# EAGLE design pvsim (EAGLE 6.3)
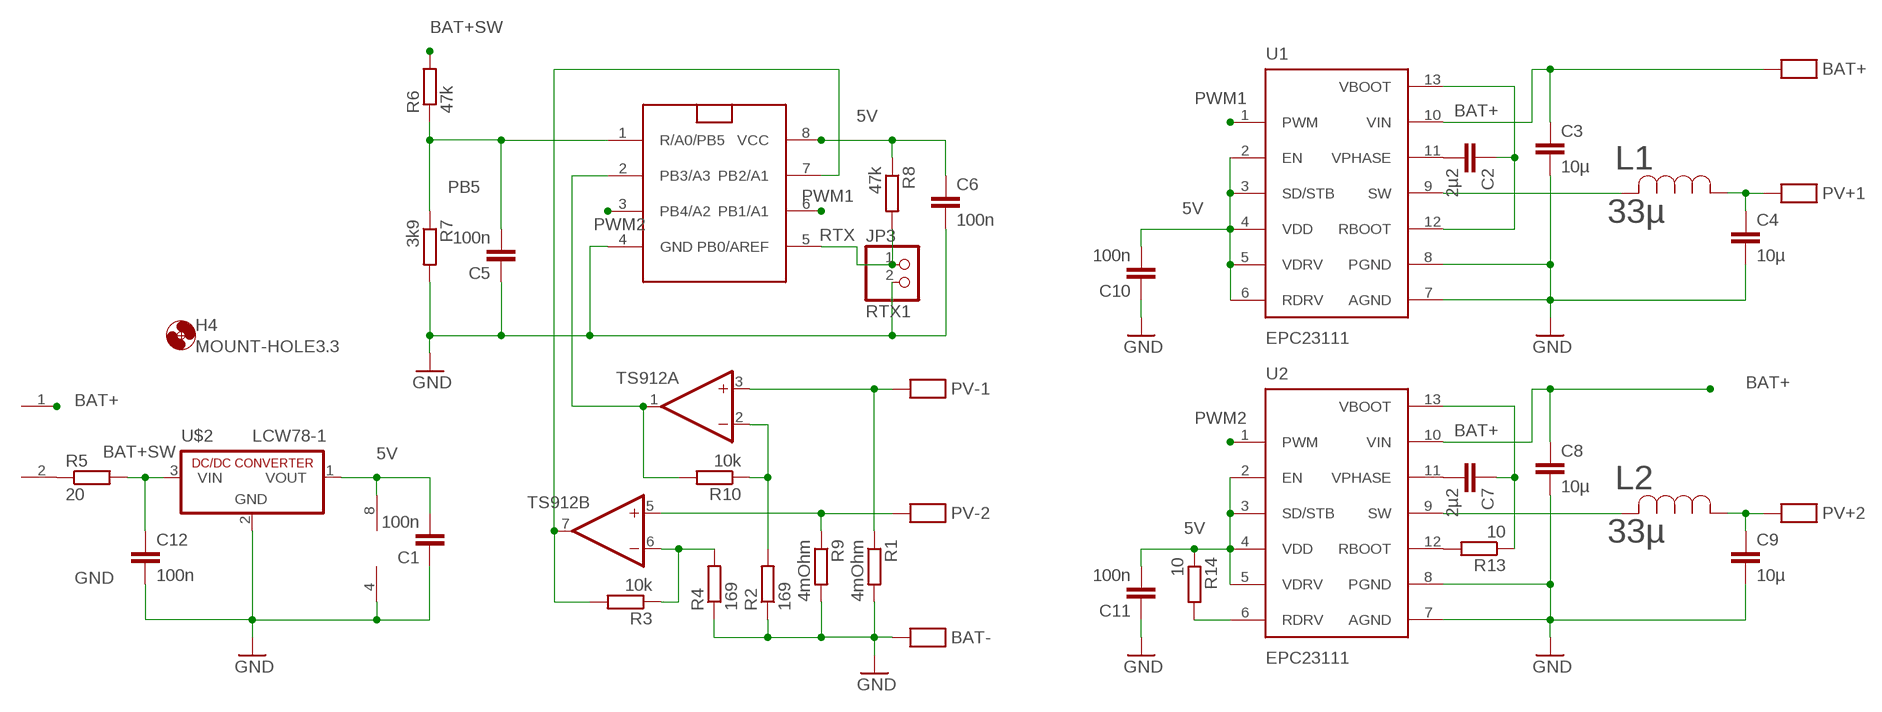
[diagram p0: schematic, sheet 1]

## Parts
BAT+  SMD_10X5  [SMD_10X5]
BAT-  SMD_10X5  [SMD_10X5]
C1  100n  C-EUC0805  [C0805]
C2  2µ2  C-EUC0805K  [C0805K]
C3  10µ  C-EUC1210K  [C1210K]
C4  10µ  C-EUC1210K  [C1210K]
C5  100n  C-EUC0805  [C0805]
C6  100n  C-EUC0805  [C0805]
C7  2µ2  C-EUC1206K  [C1206K]
C8  10µ  C-EUC1210K  [C1210K]
C9  10µ  C-EUC1210K  [C1210K]
C10  100n  C-EUC0805  [C0805]
C11  100n  C-EUC0805  [C0805]
C12  100n  C-EUC0805  [C0805]
FK1  Start  DG250-3.5-2  [DG250-3.5-2]
H4  MOUNT-HOLE3.3  [3,3]
JP3  RTX1  PINHD-1X2  [1X02]
L1  33µ  PA4349.333ANLTIND_PA4349.333ANLT_PUL-M  [IND_PA4349.333ANLT_PUL-M]
L2  33µ  PA4349.333ANLTIND_PA4349.333ANLT_PUL-M  [IND_PA4349.333ANLT_PUL-M]
PV+1  SMD_10X5  [SMD_10X5]
PV+2  SMD_10X5  [SMD_10X5]
PV-1  SMD_10X5  [SMD_10X5]
PV-2  SMD_10X5  [SMD_10X5]
R1  4mOhm  R-EU_R2512  [R2512]
R2  169  R-EU_R0805  [R0805]
R3  10k  R-EU_R0805  [R0805]
R4  169  R-EU_R0805  [R0805]
R5  20  R-EU_0207/10  [0207/10]
R6  47k  R-EU_R0805  [R0805]
R7  3k9  R-EU_R0805  [R0805]
R8  47k  R-EU_R0805  [R0805]
R9  4mOhm  R-EU_R2512  [R2512]
R10  10k  R-EU_R0805  [R0805]
R13  10  R-EU_R0805  [R0805]
R14  10  R-EU_R0805  [R0805]
TS912  2AMP_P8+4D  [SO08]
U1  EPC23111  [EPC23111_QFN13_EPC_LP]
U2  EPC23111  [EPC23111_QFN13_EPC_LP]
U$2  LCW78-1  [SIP3]
U$4  FUNKY  [FUNKYTINY]

## Nets
5V: C1.2 C6.1 C10.2 C11.2 R8.1 R14.1 TS912.8(P:V+) U1.2(EN) U1.3(SD/STB) U1.4(VDD) U1.5(VDRV) U1.6(RDRV) U2.2(EN) U2.3(SD/STB) U2.4(VDD) U2.5(VDRV) U$2.1(VOUT) U$4.8(VCC)
BAT+: BAT+.P$1(MP) C3.1 C8.1 FK1.1 U1.10(VIN) U2.10(VIN)
BAT+SW: C12.1 R5.2 R6.2 U$2.3(VIN)
BAT-: R9.2
GND: BAT-.P$1(MP) C1.1 C3.2 C4.2 C5.1 C6.2 C8.2 C9.2 C10.1 C11.1 C12.2 JP3.2 R1.2 R2.1 R4.1 R7.2 TS912.4(P:V-) U1.7(AGND) U1.8(PGND) U2.7(AGND) U2.8(PGND) U$2.2(GND) U$4.4(GND)
IPV1: PV-1.P$1(MP) R1.1 TS912.3(A:+IN)
IPV2: PV-2.P$1(MP) R9.1 TS912.5(B:+IN)
N$1: R10.2 TS912.1(A:OUT) U$4.2(PB3/A3)
N$2: R2.2 R10.1 TS912.2(A:-IN)
N$3: R3.2 TS912.7(B:OUT) U$4.7(PB2/A1)
N$4: R3.1 R4.2 TS912.6(B:-IN)
N$5: FK1.2 R5.1
N$7: C2.1 U1.12(RBOOT) U1.13(VBOOT)
N$8: C2.2 U1.11(VPHASE)
N$9: C4.1 L1.1 PV+1.P$1(MP)
N$11: L1.2 U1.9(SW)
N$12: C7.1 R13.1 U2.13(VBOOT)
N$13: C7.2 U2.11(VPHASE)
N$14: L2.2 U2.9(SW)
N$15: C9.1 L2.1 PV+2.P$1(MP)
N$43: R13.2 U2.12(RBOOT)
N$44: R14.2
PB5: C5.2 R6.1 R7.1 U$4.1(R/A0/PB5)
PWM1: U1.1(PWM) U$4.6(PB1/A1)
PWM2: U2.1(PWM) U$4.3(PB4/A2)
RTX: JP3.1 R8.2 U$4.5(PB0/AREF)
Unconnected: U2.6(RDRV)

## Library data of the parts
BAT+ BAT- PV+1 PV+2 PV-1 PV-2 = solpad:SMD_10X5
C1-C12 = rcl:C-EU: CAPACITOR, European symbol
FK1 = degson:DG250-3.5-2: Federkraftklemme RM3.5 2x
H4 = holes:MOUNT-HOLE: MOUNTING HOLE with drill center marker
JP3 = pinhead:PINHD-1X2: PIN HEADER
L1 L2 = MYLIB:PA4349.333ANLT; COPYRIGHT: Copyright (C) 2021 Ultra Librarian. All rights reserved.; DIGI-KEY_PART_NUMBER_1: 553-4049-2-ND; DIGI-KEY_PART_NUMBER_2: 553-4049-1-ND; DIGI-KEY_PART_NUMBER_3: 553-4049-6-ND; MANUFACTURER_PART_NUMBER: PA4349.333ANLT; MFR_NAME: Pulse Electronics Corporation
R1-R10 R13 R14 = rcl:R-EU_: RESISTOR, European symbol
TS912 = linear:2AMP_P8+4: OP AMP
U1 U2 = EPC23111_Eagle63:EPC23111: EPC23111 ePower Stage IC, 100 V, 20 A, single PWM input.
U$2 = dc-dc-converter:LCW78-1
U$4 = MYLIB:FUNKY

## Board
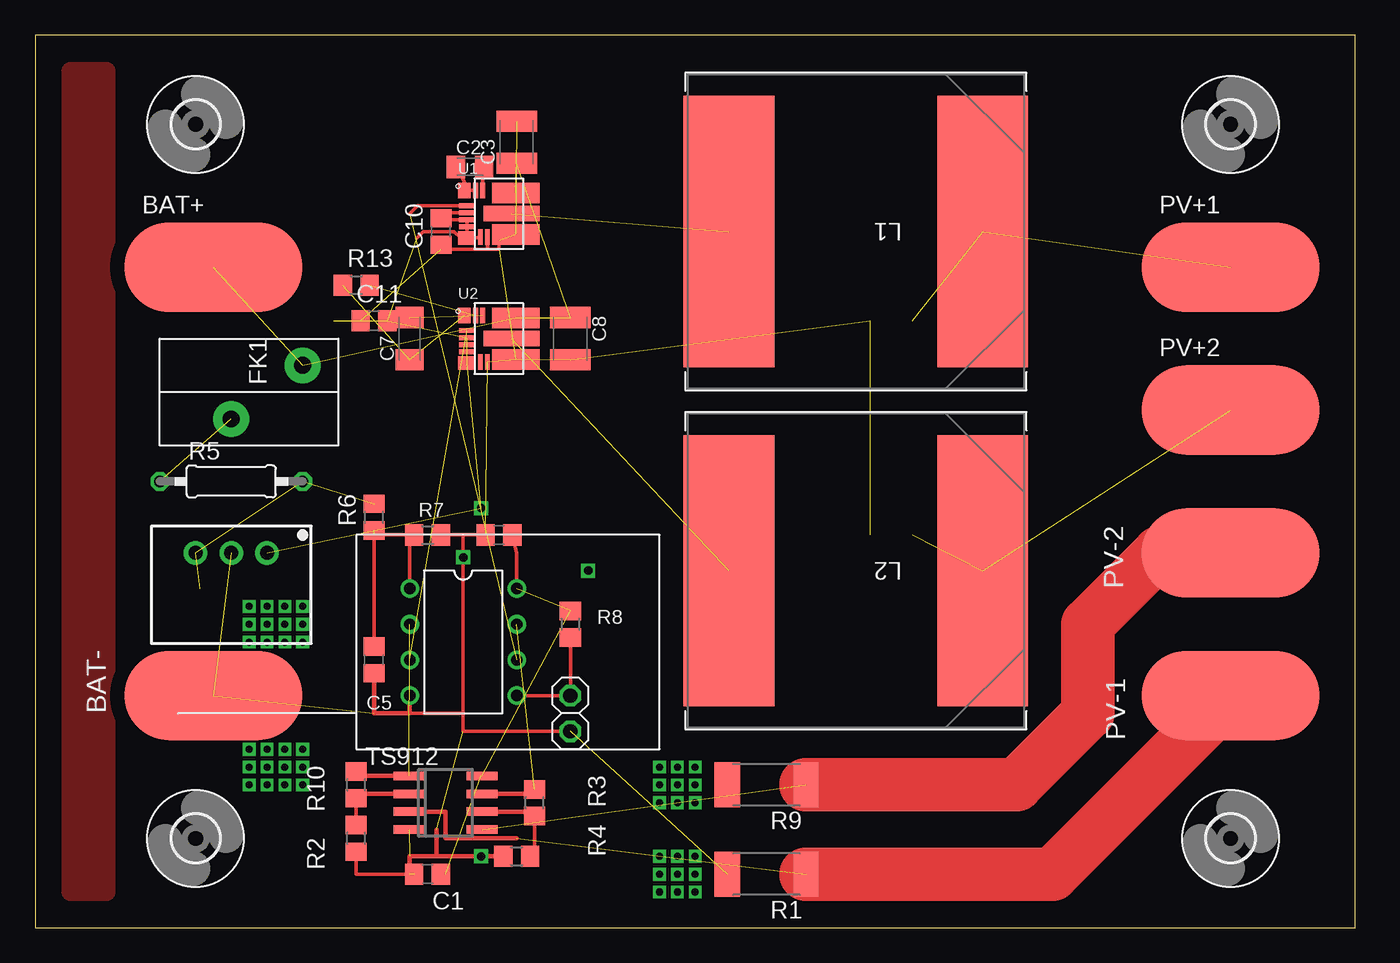
[diagram p1: board, top side]
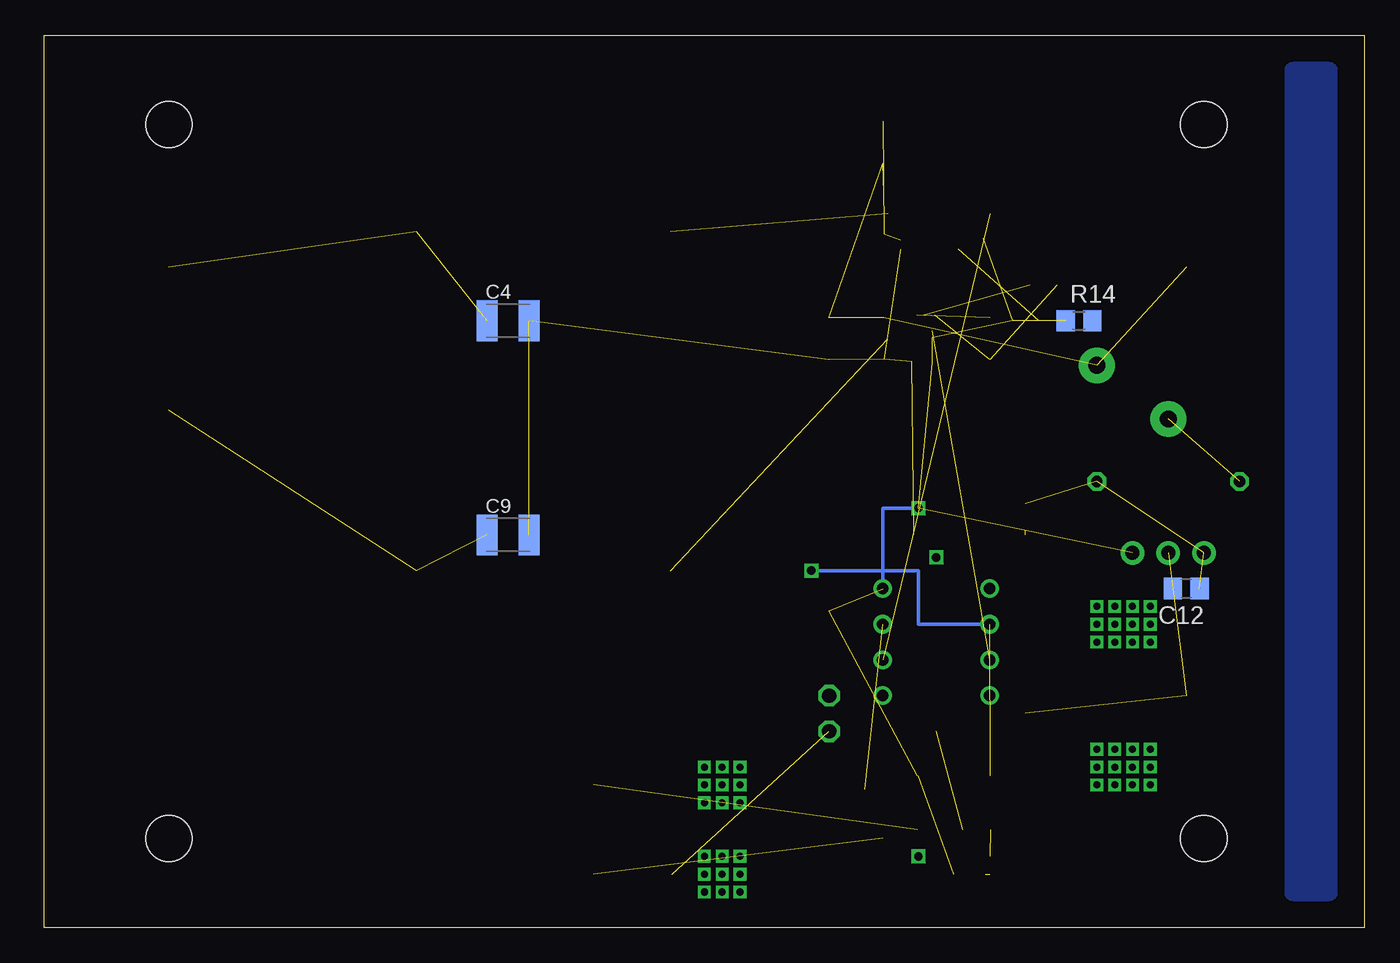
[diagram p2: board, bottom side, seen from below]

Size 93.97 x 63.49 mm. Coordinates in mm from the lower left corner, seen from the top.
Outline: 93.97,63.49 0,63.49 0,0 93.97,0 93.97,63.49
Copper layers (1*16): Top 0.035mm / dielectric 1.5mm / Bottom 0.035mm
Design rules "default *": minimum track width 10mil, minimum drill 23mil, track to track 6mil, track to pad 6mil, pad to pad 6mil, via to via 6mil, smd to smd 6mil, copper to edge 40mil, drill to drill 8mil, minimum pad ring 10mil, minimum via ring 8mil, stop-mask expansion 4mil, vias tented up to drill 0mil, thermal gap 40mil

### Footprints (pad centres in the part's own frame; a part is rotated, then mirrored left to right if it is on the bottom)
SMD_10X5 = smd 12.7 x 6.35: P$1 0,0
C0805 = smd 1.3 x 1.5: 1 -0.95,0; 2 0.95,0
C0805K = smd 1.3 x 1.6: 1 -1,0; 2 1,0
C1210K = smd 1.5 x 2.9: 1 -1.5,0; 2 1.5,0
C1206K = smd 1.5 x 2: 1 -1.5,0; 2 1.5,0
DG250-3.5-2 = drill 1.2 pad 2.54: 1 -1.905,3.81; 2 1.905,-1.27
3,3 = hole 3.3: 0,0
1X02 = drill 1.016 octagon: 1 -1.27,0; 2 1.27,0
IND_PA4349.333ANLT_PUL-M = smd 6.452 x 19.304: 1 -9.03,0; 2 9.03,0
R2512 = smd 1.8 x 3.2: 1 -2.8,0; 2 2.8,0
R0805 = smd 1.3 x 1.5: 1 -0.95,0; 2 0.95,0
0207/10 = drill 0.813 octagon: 1 -5.08,0; 2 5.08,0
SO08 = smd 0.6 x 2.2: 1 -1.905,-2.6; 2 -0.635,-2.6; 3 0.635,-2.6; 4 1.905,-2.6; 5 1.905,2.6; 6 0.635,2.6; 7 -0.635,2.6; 8 -1.905,2.6
EPC23111_QFN13_EPC_LP = smd 1.1 x 0.35: 1 -2.275,0.575; 2 -2.275,0.075; 3 -2.275,-0.425; 4 -2.275,-0.925 | smd 1.25 x 0.95: 5 -2.275,-1.725 | smd 0.35 x 1.1: 6 -1.325,-1.65; 7 -0.825,-1.65; 11 -1.175,1.65; 12 -1.675,1.65 | smd 3.4 x 1.45: 8 1.2,-1.475; 10 1.2,1.475 | smd 4 x 1.1: 9 0.9,0 | smd 0.9 x 1.1: 13 -2.45,1.65
SIP3 = drill 1 pad 1.676: 1 -2.54,0; 2 0,0; 3 2.54,0
FUNKYTINY = drill 0.813: 1 -3.81,3.81; 2 -3.81,1.27; 3 -3.81,-1.27; 4 -3.81,-3.81; 5 3.81,-3.81; 6 3.81,-1.27; 7 3.81,1.27; 8 3.81,3.81

### Placement (x,y rotation side)
BAT+  12.69,46.98 0 top
BAT-  12.69,16.5 0 top
C1  27.93,3.8 0 top
C2  30.94,54.12 0 top
C3  34.28,55.87 90 top
C4  60.95,43.17 0 bottom
C5  24.12,19.04 90 top
C6  33.01,27.93 180 top
C7  26.66,41.9 90 top
C8  38.09,41.9 270 top
C9  60.95,27.93 0 bottom
C10  28.88,49.52 90 top
C11  24.12,43.17 0 top
C12  12.69,24.12 180 bottom
FK1  15.23,38.09 270 top
H1  MOUNT-HOLE3.3  [3,3]  11.42,57.14 0 top
H2  MOUNT-HOLE3.3  [3,3]  85.08,57.14 0 top
H3  MOUNT-HOLE3.3  [3,3]  85.08,6.34 0 top
H4  11.42,6.34 0 top
JP3  38.09,15.23 270 top
L1  58.41,49.52 180 top
L2  58.41,25.39 180 top
PV+1  85.08,46.98 0 top
PV+2  85.08,36.82 0 top
PV-1  85.08,16.5 180 top
PV-2  85.08,26.66 0 top
R1  52.06,3.8 180 top
R2  22.85,6.34 90 top
R3  35.55,8.88 90 top
R4  34.28,5.07 0 top
R5  13.96,31.74 0 top
R6  24.12,29.2 90 top
R7  27.93,27.93 0 top
R8  38.09,21.58 270 top
R9  52.06,10.15 180 top
R10  22.85,10.15 90 top
R13  22.85,45.71 0 top
R14  20.31,43.17 0 bottom
TS912  29.2,8.88 270 top
U1  33.01,50.79 0 top
U2  33.01,41.9 0 top
U$2  13.96,26.66 180 top
U$4  30.47,20.31 0 top

### Tracks (layer width: path | path; a pad name or v marks a point on that pad's centre or on a via)
5V  (via drill 0.6)  (11 unrouted)
  Top 0.254: U$4.8 34.28,26.66 C6.1 | 29.2,3.8 C1.2 | TS912.8 31.74,10.78 | U1.2 29.28,50.87 C10.2 28.98,50.37 U1.3 U1.4 U1.5 | U1.5 31.61,49.07 U1.6 | U1.5 30.29,49.07 29.83,49.52 27.61,49.52 27.13,49.04
  Bottom 0.254: v31.74,29.84 34.28,29.84 U$4.8
BAT+  (5 unrouted)
BAT+SW  (3 unrouted)
BAT-
  pour Bottom (isolate 1.27, rank 2): 5.07,60.95 5.07,2.53 2.53,2.53 2.53,60.95
  pour Top (isolate 1.016): 2.53,60.95 5.07,60.95 5.07,2.53 2.53,2.53
GND  (via drill 0.6)  (16 unrouted)
  Top 0.254: JP3.2 30.47,13.96 30.47,15.23 | 30.47,15.23 26.66,15.23 | C6.2 30.47,27.93 | R7.2 30.47,27.93 | 30.47,15.23 v30.47,26.34 30.47,27.93 | 33.01,5.07 R4.1 | 26.66,3.8 22.85,3.8 R2.1 | C10.1 28.88,48.25 32.21,48.25 | 32.21,48.25 33.01,48.25 33.01,48.88 | U1.7 32.18,48.28 32.21,48.25
  Top 0.305: U$4.4 26.66,15.23 24.12,15.23 C5.1 | 28.56,6.97 28.56,5.07 | 28.56,5.07 v31.74,5.07 R4.1 | 28.56,5.07 26.66,5.07 26.66,3.8
IPV1  (1 unrouted)
  Top 0.305: 34.28,6.34 29.2,6.34 29.2,8.24 TS912.3
  Top 3.81: R1.1 72.38,3.8 PV-1.P$1
IPV2  (1 unrouted)
  Top 3.81: R9.1 69.84,10.15 74.92,15.23 74.92,21.58 80,26.66 PV-2.P$1
N$1  (via drill 0.6)  (1 unrouted)
  Top 0.305: TS912.1 22.85,10.78 R10.2
  Bottom 0.254: v39.36,25.39 31.74,25.39 31.74,21.58 U$4.2
N$2
  Top 0.254: R2.2 R10.1
  Top 0.305: TS912.2 22.85,9.51 R10.1
N$3  (1 unrouted)
  Top 0.305: TS912.7 35.55,9.51 R3.2
N$4
  Top 0.254: R3.1 35.55,5.07 R4.2
  Top 0.305: TS912.6 35.55,8.24 R3.1
N$5  (1 unrouted)
N$6  (via drill 0.5)
  other vias: 15.23,21.58
N$7
  Top 0.254: U1.12 U1.13 30.56,53.03 C2.1
N$8
  Top 0.254: U1.11 31.83,53.76 C2.2
N$9  (2 unrouted)
N$10  (via drill 0.5)
  other vias: 44.44,11.42
N$11  (1 unrouted)
N$12  (2 unrouted)
N$13  (1 unrouted)
N$14  (1 unrouted)
N$15  (2 unrouted)
N$16  (via drill 0.5)
  other vias: 45.71,11.42
N$17  (via drill 0.5)
  other vias: 46.98,11.42
N$18  (via drill 0.5)
  other vias: 46.98,10.15
N$19  (via drill 0.5)
  other vias: 46.98,8.88
N$20  (via drill 0.5)
  other vias: 45.71,8.88
N$21  (via drill 0.5)
  other vias: 44.44,8.88
N$22  (via drill 0.5)
  other vias: 15.23,22.85
N$24  (via drill 0.5)
  other vias: 44.44,10.15
N$25  (via drill 0.5)
  other vias: 45.71,10.15
N$26  (via drill 0.5)
  other vias: 44.44,5.07
N$27  (via drill 0.5)
  other vias: 45.71,5.07
N$28  (via drill 0.5)
  other vias: 46.98,5.07
N$29  (via drill 0.5)
  other vias: 46.98,3.8
N$30  (via drill 0.5)
  other vias: 46.98,2.53
N$31  (via drill 0.5)
  other vias: 45.71,2.53
N$32  (via drill 0.5)
  other vias: 45.71,3.8
N$33  (via drill 0.5)
  other vias: 44.44,3.8
N$34  (via drill 0.5)
  other vias: 44.44,2.53
N$36  (via drill 0.5)
  other vias: 16.5,22.85
N$37  (via drill 0.5)
  other vias: 16.5,21.58
N$38  (via drill 0.5)
  other vias: 16.5,20.31
N$39  (via drill 0.5)
  other vias: 15.23,20.31
N$40  (via drill 0.5)
  other vias: 17.77,20.31
N$41  (via drill 0.5)
  other vias: 17.77,21.58
N$42  (via drill 0.5)
  other vias: 17.77,22.85
N$43  (1 unrouted)
N$45  (via drill 0.5)
  other vias: 19.04,22.85
N$46  (via drill 0.5)
  other vias: 19.04,21.58
N$47  (via drill 0.5)
  other vias: 19.04,20.31
N$49  (via drill 0.5)
  other vias: 15.23,12.69
N$50  (via drill 0.5)
  other vias: 16.5,12.69
N$51  (via drill 0.5)
  other vias: 17.77,12.69
N$52  (via drill 0.5)
  other vias: 19.04,12.69
N$53  (via drill 0.5)
  other vias: 15.23,11.42
N$54  (via drill 0.5)
  other vias: 16.5,11.42
N$55  (via drill 0.5)
  other vias: 17.77,11.42
N$56  (via drill 0.5)
  other vias: 19.04,11.42
N$57  (via drill 0.5)
  other vias: 15.23,10.15
N$58  (via drill 0.5)
  other vias: 16.5,10.15
N$59  (via drill 0.5)
  other vias: 17.77,10.15
N$60  (via drill 0.5)
  other vias: 19.04,10.15
PB5  (1 unrouted)
  Top 0.254: C5.2 24.12,27.93 26.66,27.93 | U$4.1 26.66,27.93 | 26.66,27.93 R7.1
PWM1  (1 unrouted)
  Top 0.254: U1.1 27.23,51.37 26.66,50.79
PWM2  (1 unrouted)
RTX
  Top 0.254: U$4.5 JP3.1 R8.2